# EAGLE schematic Main Brd (EAGLE 9.6.2)
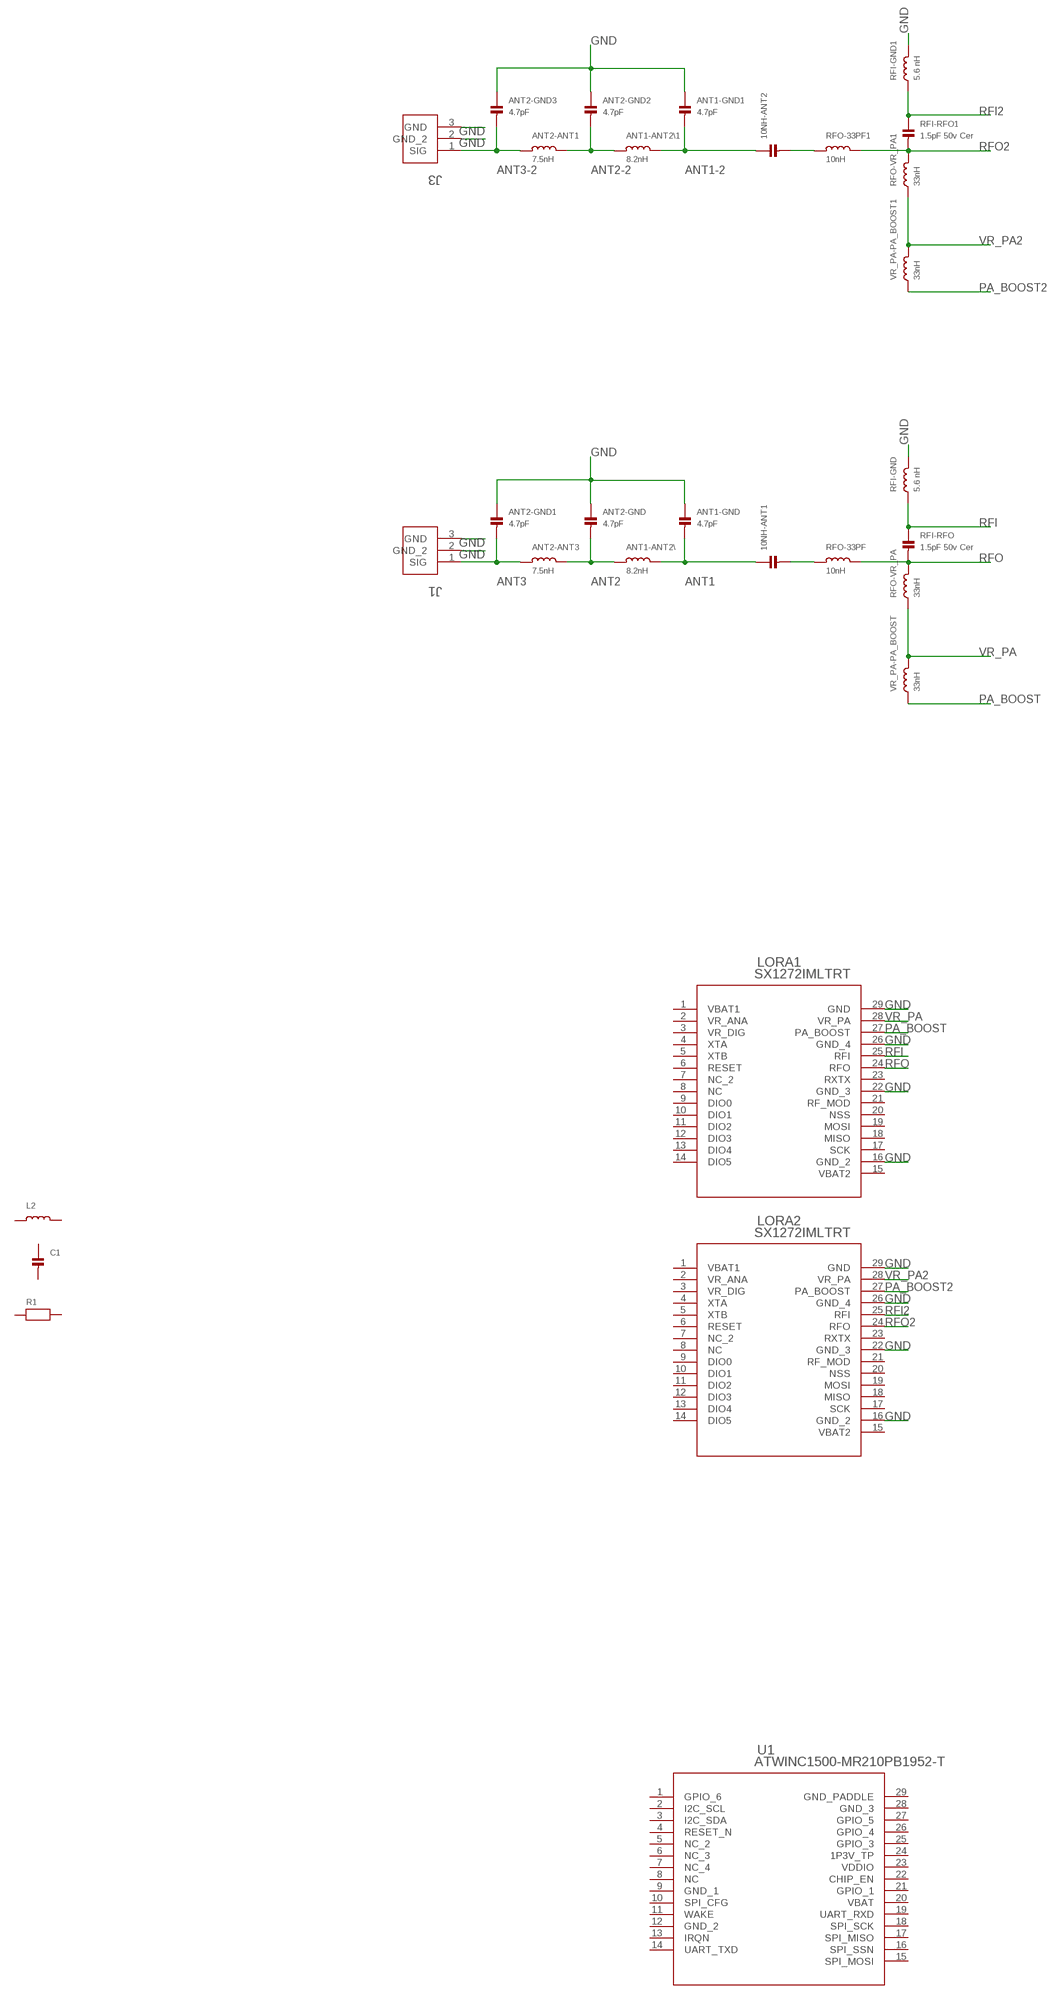
[diagram p0: schematic, sheet 1, part 1 of 2]
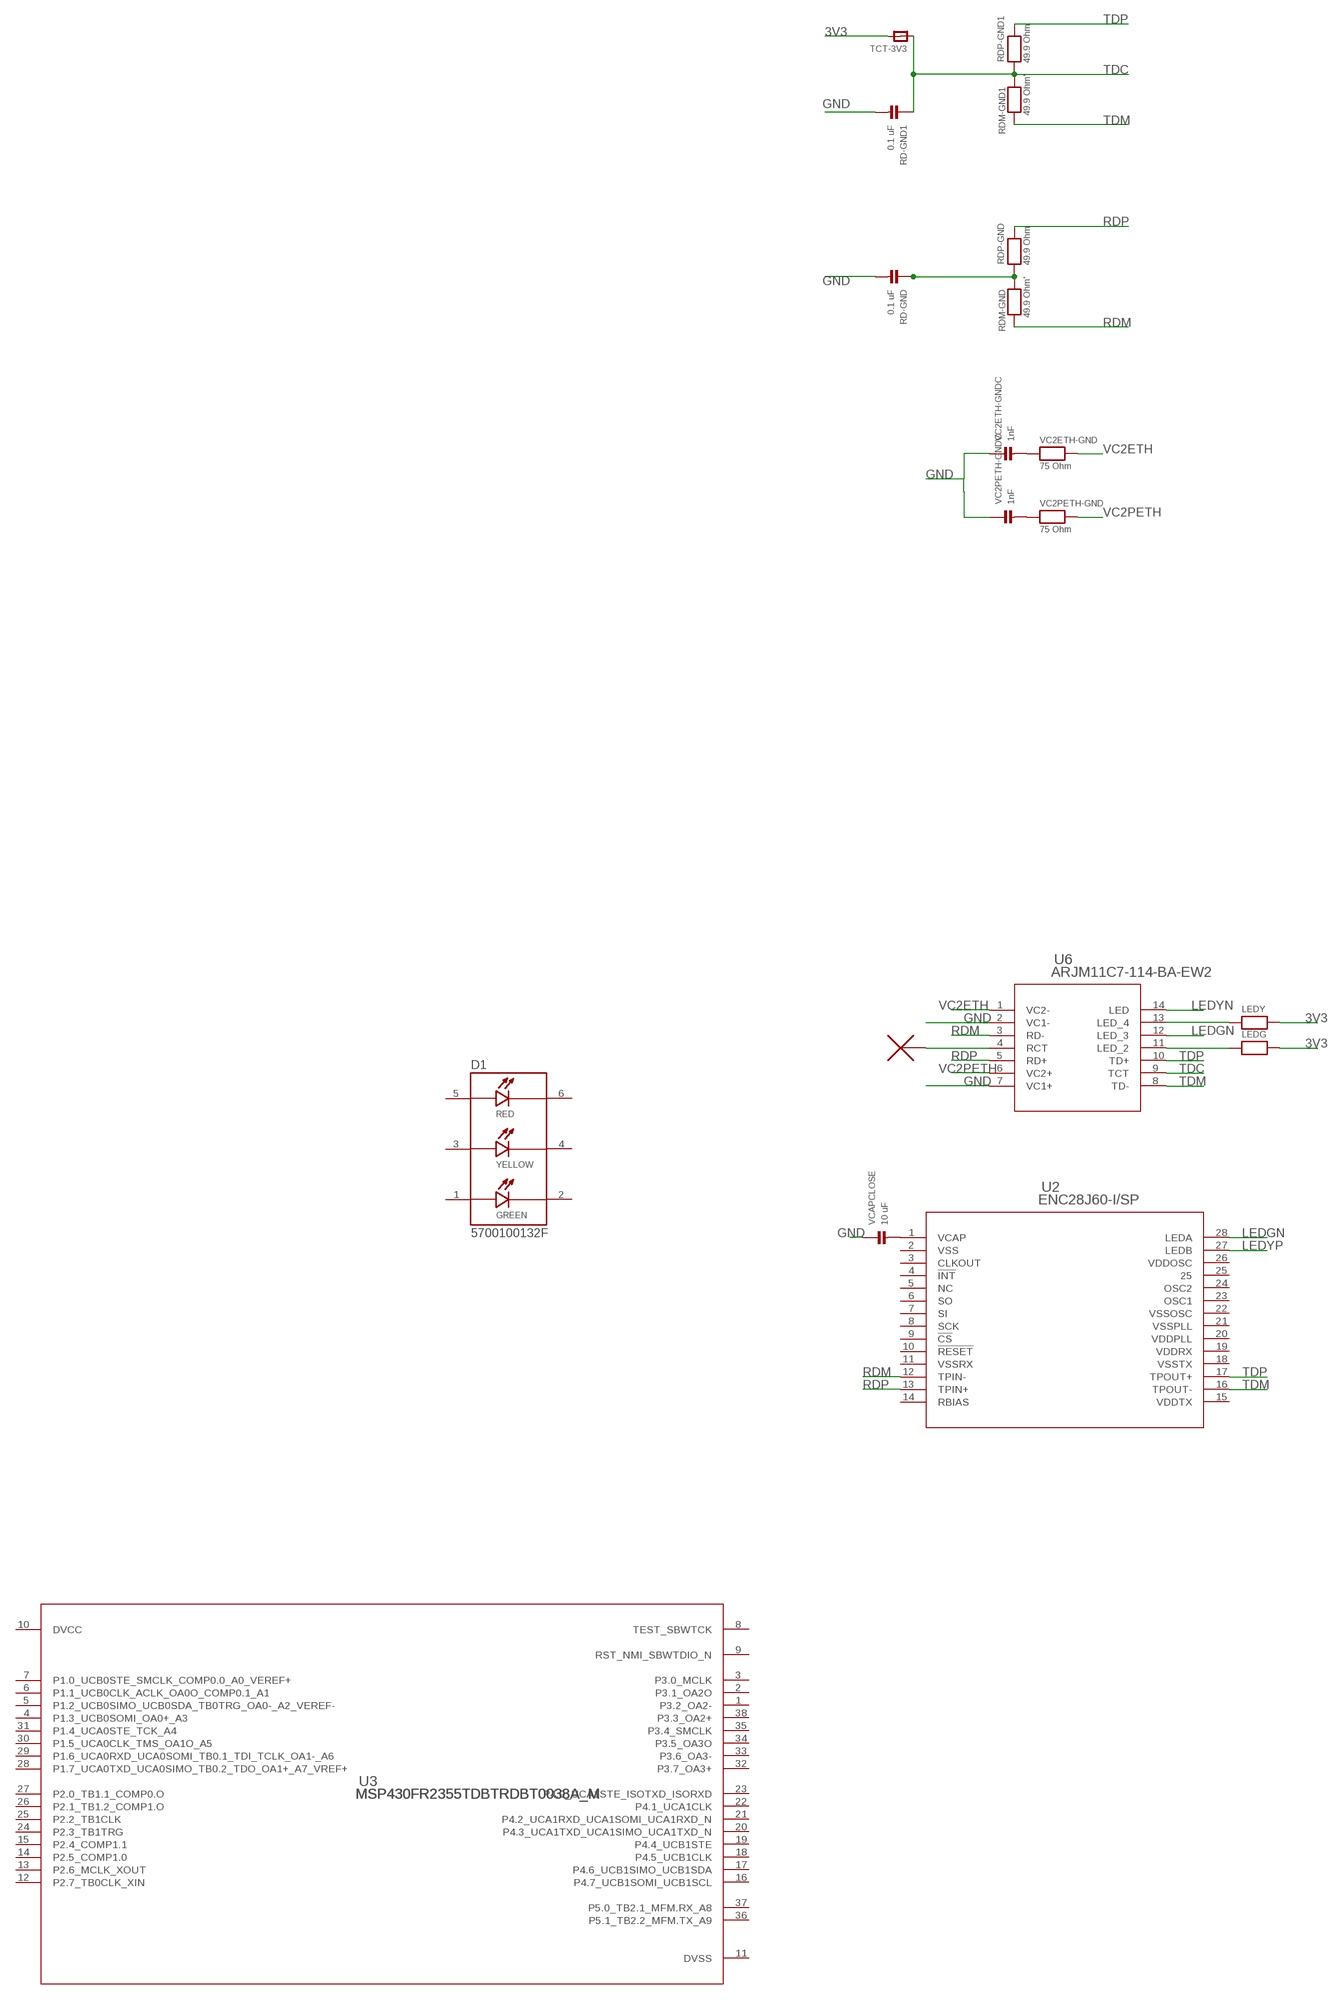
[diagram p1: schematic, sheet 1, part 2 of 2]

## Parts
10NH-ANT1  CAP_CERAMIC0402  [0402]
10NH-ANT2  CAP_CERAMIC0402  [0402]
ANT1-ANT2\  8.2nH  INDUCTOR_0402  [_0402]
ANT1-ANT2\1  8.2nH  INDUCTOR_0402  [_0402]
ANT1-GND  4.7pF  CAP_CERAMIC0402  [0402]
ANT1-GND1  4.7pF  CAP_CERAMIC0402  [0402]
ANT2-ANT1  7.5nH  INDUCTOR_0402  [_0402]
ANT2-ANT3  7.5nH  INDUCTOR_0402  [_0402]
ANT2-GND  4.7pF  CAP_CERAMIC0402  [0402]
ANT2-GND1  4.7pF  CAP_CERAMIC0402  [0402]
ANT2-GND2  4.7pF  CAP_CERAMIC0402  [0402]
ANT2-GND3  4.7pF  CAP_CERAMIC0402  [0402]
C1  CAP_CERAMIC0402  [0402]
D1  5700100132F  [LED_5700100132F]
J1  1909763-1  [CONN3_1909763_TEC]
J3  1909763-1  [CONN3_1909763_TEC]
L2  INDUCTOR_0402  [_0402]
LEDG  RESISTOR0402  [0402]
LEDY  RESISTOR0402  [0402]
LORA1  SX1272IMLTRT  [QFN28_6X6_SEM]
LORA2  SX1272IMLTRT  [QFN28_6X6_SEM]
R1  RESISTOR0402  [0402]
RD-GND  0.1 uF  CAP_CERAMIC0402  [0402]
RD-GND1  0.1 uF  CAP_CERAMIC0402  [0402]
RDM-GND  49.9 Ohm'  RESISTOR0402  [0402]
RDM-GND1  49.9 Ohm'  RESISTOR0402  [0402]
RDP-GND  49.9 Ohm  RESISTOR0402  [0402]
RDP-GND1  49.9 Ohm  RESISTOR0402  [0402]
RFI-GND  5.6 nH  INDUCTOR_0402  [_0402]
RFI-GND1  5.6 nH  INDUCTOR_0402  [_0402]
RFI-RFO  1.5pF 50v Cer  CAP_CERAMIC0402  [0402]
RFI-RFO1  1.5pF 50v Cer  CAP_CERAMIC0402  [0402]
RFO-33PF  10nH  INDUCTOR_0402  [_0402]
RFO-33PF1  10nH  INDUCTOR_0402  [_0402]
RFO-VR_PA  33nH  INDUCTOR_0402  [_0402]
RFO-VR_PA1  33nH  INDUCTOR_0402  [_0402]
TCT-3V3  FERRITE  [0603]
U1  ATWINC1500-MR210PB1952-T  [ATWINC15X0-MR210_MCH]
U2  ENC28J60-I/SP  [SPDIP28_300MC_MCH]
U3  MSP430FR2355TDBTRDBT0038A_M  [DBT0038A_M]
U6  ARJM11C7-114-BA-EW2  [ARJM11C7-114-BA-EW2_ABR]
U$1  NC_MARKER  (no package)
VC2ETH-GND  75 Ohm  RESISTOR0402  [0402]
VC2ETH-GNDC  1nF  CAP_CERAMIC0402  [0402]
VC2PETH-GND  75 Ohm  RESISTOR0402  [0402]
VC2PETH-GNDC  1nF  CAP_CERAMIC0402  [0402]
VCAPCLOSE  10 uF  CAP_CERAMIC0805  [0805]
VR_PA-PA_BOOST  33nH  INDUCTOR_0402  [_0402]
VR_PA-PA_BOOST1  33nH  INDUCTOR_0402  [_0402]

## Nets
3V3: LEDG.2 LEDY.2 TCT-3V3.2
ANT1: 10NH-ANT1.1 ANT1-ANT2\.2 ANT1-GND.2
ANT1-2: 10NH-ANT2.1 ANT1-ANT2\1.2 ANT1-GND1.2
ANT2: ANT1-ANT2\.1 ANT2-ANT3.2 ANT2-GND.2
ANT2-2: ANT1-ANT2\1.1 ANT2-ANT1.2 ANT2-GND2.2
ANT3: ANT2-ANT3.1 ANT2-GND1.2 J1.1(SIG)
ANT3-2: ANT2-ANT1.1 ANT2-GND3.2 J3.1(SIG)
GND: ANT1-GND1.1 ANT1-GND.1 ANT2-GND1.1 ANT2-GND2.1 ANT2-GND3.1 ANT2-GND.1 J1.2(GND_2) J1.3(GND) J3.2(GND_2) J3.3(GND) LORA1.16(GND_2) LORA1.22(GND_3) LORA1.26(GND_4) LORA1.29(GND) LORA2.16(GND_2) LORA2.22(GND_3) LORA2.26(GND_4) LORA2.29(GND) RD-GND1.2 RD-GND.2 RFI-GND1.2 RFI-GND.2 U6.2(VC1-) U6.7(VC1+) VC2ETH-GNDC.1 VC2PETH-GNDC.1 VCAPCLOSE.1
LEDGN: U2.28(LEDA) U6.12(LED_3)
LEDYN: U6.14(LED)
LEDYP: U2.27(LEDB)
N$1: 10NH-ANT1.2 RFO-33PF.1
N$2: 10NH-ANT2.2 RFO-33PF1.1
N$3: U6.4(RCT) U$1.P$1
N$4: U2.1(VCAP) VCAPCLOSE.2
N$5: VC2ETH-GND.1 VC2ETH-GNDC.2
N$6: VC2PETH-GND.1 VC2PETH-GNDC.2
N$7: LEDY.1 U6.13(LED_4)
N$8: RD-GND.1 RDM-GND.1 RDP-GND.1
N$9: LEDG.1 U6.11(LED_2)
PA_BOOST: LORA1.27(PA_BOOST) VR_PA-PA_BOOST.1
PA_BOOST2: LORA2.27(PA_BOOST) VR_PA-PA_BOOST1.1
RDM: RDM-GND.2 U2.12(TPIN-) U6.3(RD-)
RDP: RDP-GND.2 U2.13(TPIN+) U6.5(RD+)
RFI: LORA1.25(RFI) RFI-GND.1 RFI-RFO.1
RFI2: LORA2.25(RFI) RFI-GND1.1 RFI-RFO1.1
RFO: LORA1.24(RFO) RFI-RFO.2 RFO-33PF.2 RFO-VR_PA.2
RFO2: LORA2.24(RFO) RFI-RFO1.2 RFO-33PF1.2 RFO-VR_PA1.2
TDC: RD-GND1.1 RDM-GND1.1 RDP-GND1.1 TCT-3V3.1 U6.9(TCT)
TDM: RDM-GND1.2 U2.16(TPOUT-) U6.8(TD-)
TDP: RDP-GND1.2 U2.17(TPOUT+) U6.10(TD+)
VC2ETH: U6.1(VC2-) VC2ETH-GND.2
VC2PETH: U6.6(VC2+) VC2PETH-GND.2
VR_PA: LORA1.28(VR_PA) RFO-VR_PA.1 VR_PA-PA_BOOST.2
VR_PA2: LORA2.28(VR_PA) RFO-VR_PA1.1 VR_PA-PA_BOOST1.2
Unconnected: C1.1 C1.2 D1.1(A_GREEN) D1.2(C_GREEN) D1.3(A_YELLOW) D1.4(C_YELLOW) D1.5(A_RED) D1.6(C_RED) L2.1 L2.2 LORA1.4(XTA) LORA1.5(XTB) LORA1.6(RESET) LORA1.7(NC_2) LORA1.8(NC) LORA1.9(DIO0) LORA1.10(DIO1) LORA1.11(DIO2) LORA1.12(DIO3) LORA1.13(DIO4) LORA1.14(DIO5) LORA1.17(SCK) LORA1.18(MISO) LORA1.19(MOSI) LORA1.20(NSS) LORA1.21(RF_MOD) LORA1.23(RXTX) LORA2.4(XTA) LORA2.5(XTB) LORA2.6(RESET) LORA2.7(NC_2) LORA2.8(NC) LORA2.9(DIO0) LORA2.10(DIO1) LORA2.11(DIO2) LORA2.12(DIO3) LORA2.13(DIO4) LORA2.14(DIO5) LORA2.17(SCK) LORA2.18(MISO) LORA2.19(MOSI) LORA2.20(NSS) LORA2.21(RF_MOD) LORA2.23(RXTX) R1.1 R1.2 U1.1(GPIO_6) U1.2(I2C_SCL) U1.3(I2C_SDA) U1.4(RESET_N) U1.5(NC_2) U1.6(NC_3) U1.7(NC_4) U1.8(NC) U1.9(GND_1) U1.10(SPI_CFG) U1.11(WAKE) U1.12(GND_2) U1.13(IRQN) U1.14(UART_TXD) U1.15(SPI_MOSI) U1.16(SPI_SSN) U1.17(SPI_MISO) U1.18(SPI_SCK) U1.19(UART_RXD) U1.21(GPIO_1) U1.22(CHIP_EN) U1.24(1P3V_TP) U1.25(GPIO_3) U1.26(GPIO_4) U1.27(GPIO_5) U1.28(GND_3) U1.29(GND_PADDLE) U2.2(VSS) U2.3(CLKOUT) U2.4(!INT) U2.5(NC) U2.6(SO) U2.7(SI) U2.8(SCK) U2.9(!CS) U2.10(!RESET) U2.11(VSSRX) U2.14(RBIAS) U2.15(VDDTX) U2.18(VSSTX) U2.19(VDDRX) U2.20(VDDPLL) U2.21(VSSPLL) U2.22(VSSOSC) U2.23(OSC1) U2.24(OSC2) U2.25 U2.26(VDDOSC) U3.1(P3.2_OA2-) U3.2(P3.1_OA2O) U3.3(P3.0_MCLK) U3.4(P1.3_UCB0SOMI_OA0+_A3) U3.5(P1.2_UCB0SIMO_UCB0SDA_TB0TRG_OA0-_A2_VEREF-) U3.6(P1.1_UCB0CLK_ACLK_OA0O_COMP0.1_A1) U3.7(P1.0_UCB0STE_SMCLK_COMP0.0_A0_VEREF+) U3.8(TEST_SBWTCK) U3.9(RST_NMI_SBWTDIO_N) U3.12(P2.7_TB0CLK_XIN) U3.13(P2.6_MCLK_XOUT) U3.14(P2.5_COMP1.0) U3.15(P2.4_COMP1.1) U3.16(P4.7_UCB1SOMI_UCB1SCL) U3.17(P4.6_UCB1SIMO_UCB1SDA) U3.18(P4.5_UCB1CLK) U3.19(P4.4_UCB1STE) U3.20(P4.3_UCA1TXD_UCA1SIMO_UCA1TXD_N) U3.21(P4.2_UCA1RXD_UCA1SOMI_UCA1RXD_N) U3.22(P4.1_UCA1CLK) U3.23(P4.0_UCA1STE_ISOTXD_ISORXD) U3.24(P2.3_TB1TRG) U3.25(P2.2_TB1CLK) U3.26(P2.1_TB1.2_COMP1.O) U3.27(P2.0_TB1.1_COMP0.O) U3.28(P1.7_UCA0TXD_UCA0SIMO_TB0.2_TDO_OA1+_A7_VREF+) U3.29(P1.6_UCA0RXD_UCA0SOMI_TB0.1_TDI_TCLK_OA1-_A6) U3.30(P1.5_UCA0CLK_TMS_OA1O_A5) U3.31(P1.4_UCA0STE_TCK_A4) U3.32(P3.7_OA3+) U3.33(P3.6_OA3-) U3.34(P3.5_OA3O) U3.35(P3.4_SMCLK) U3.36(P5.1_TB2.2_MFM.TX_A9) U3.37(P5.0_TB2.1_MFM.RX_A8) U3.38(P3.3_OA2+)

## Power pins joined to a net without a drawn wire
DVCC: U3.10(DVCC)
DVSS: U3.11(DVSS)
VBAT: U1.20(VBAT)
VBAT1: LORA1.1(VBAT1) LORA2.1(VBAT1)
VBAT2: LORA1.15(VBAT2) LORA2.15(VBAT2)
VDDIO: U1.23(VDDIO)
VR_ANA: LORA1.2(VR_ANA) LORA2.2(VR_ANA)
VR_DIG: LORA1.3(VR_DIG) LORA2.3(VR_DIG)

## Library data of the parts
10NH-ANT1 10NH-ANT2 ANT1-GND ANT1-GND1 ANT2-GND ANT2-GND1-ANT2-GND3 C1 RD-GND RD-GND1 RFI-RFO RFI-RFO1 VC2ETH-GNDC VC2PETH-GNDC VCAPCLOSE = microbuilder:CAP_CERAMIC: Ceramic Capacitors 0402 - 0402 Surface Mount Capacitors 16pF 50V 5% [Digikey: 445-4899-2-ND] 18pF 50V 5% [Digikey: 490-1281-2-ND] 22pF 50V 5% [Digikey: 490-1283-2-ND] 68pF 50V 5% [Digikey: 490-1289-2-ND] 0.1uF 10V 10% [Digikey: 490-1318-2-ND] 1.0uF 6.3V 10% [Digikey: 490-1320-2-ND] 0603 - 0603 Surface Mount Capacitors 16 pF 50V 5% [Digikey: 445-5051-2-ND] 22 pF 50V [Digikey: PCC220ACVTR-ND] 33 pF 50V 5% [Digikey: 490-1415-1-ND] 56pF 50V 5% [Digikey: 490-1421-1-ND] 220pF 50V 5% [Digikey: 445-1285-1-ND] 680 pF 50V 2200 pF 50V 5% C0G [Digikey: 445-1297-1-ND] 5600 pF 100V 5% X7R [Digikey: 478-3711-1-ND] 0.1 µF 25V 10% [Digikey: PCC2277TR-ND] 0.22 µF 16V 10% X7R [Digikey: 445-1318-1-ND] 1.0 µF 25V 10% [Digikey: 445-5146-2-ND] 0603 - RF Specific 3pF 250V +/-0.1pF RF [Digikey: 712-1347-1-ND] 18 pF 250V 5% [Digikey: 478-3505-1-ND or 712-1322-1-ND] 56 pF 250V 5% C0G RF [Digikey: 490-4867-1-ND] 68 pF 250V RF [Digikey: 490-4868-1-ND] 0805 - 0805 Surface Mount Capacitors 220 pF 250V 2% RF Ceramic Capacitor [Digikey: 712-1398-1-ND] 1000 pF 50V 2% NP0 Ceramic Capacitor [Digikey: 478-3760-1-ND] 0.1 µF 25V 10% Ceramic Capacitor [Digikey: PCC1828TR-ND] 1.0 µF 16V 10% Ceramic Capacitor[Digikey: 490-1691-2-ND] 10.0 µF 10V 10% Ceramic Capacitor[Digikey: 709-1228-1-ND] 10.0 uF 16V 10% Ceramic Capacitor [Digikey: 478-5165-2-ND] 47 uF 6.3V 20% Ceramic Capacitor [Digikey: 587-1779-1-ND or 399-5506-1-ND] 1206 - 1206 Surface Mount Capacitors 47uF 10V 20% Ceramic Capacitor [Digikey: 490-5528-1-ND or 399-5508-1-ND or 445-6010-1-ND] 100uF 6.3V -20%, +80% Y5V Ceramic Capacitor (Digikey: 490-4512-1-ND, Mouser: 81-GRM31CF50J107ZE1L)
ANT1-ANT2\ ANT1-ANT2\1 ANT2-ANT1 ANT2-ANT3 L2 RFI-GND RFI-GND1 RFO-33PF RFO-33PF1 RFO-VR_PA RFO-VR_PA1 VR_PA-PA_BOOST VR_PA-PA_BOOST1 = microbuilder:INDUCTOR: Inductors 0603: 10nH Ceramic Inductor - microwire antenna/RF (Digikey: 712-1434-2-ND) 0805: 560nH Ceramic Inductor - RF (Digikey: 553-1047-1-ND) 270nH Ceramic Inductor - Q = 40@250MHz, +-5%, 1 Ohm DC Resistance (Digikey: 535-10506-2-ND) 1007 (2518 Metric) SMT: 10µH 10% 250mOhm 820mA 1007 Inductor (Digikey: 587-2189-1-ND) 22µH 10% 500mOhm 580mA 1007 Inductor (Digikey: 587-2190-1-ND) 47µH 10% 950mOhm 420mA 1007 Inductor (Digikey: 587-2191-1-ND) 47µH 5% 100mOhm 1A 1008 Inductor (Digikey: 732-1816-1-ND) 5.0x5.0mm (Taiyo Yuden NR5040 Series) 6.8µH 20% 2.3A 64mOhm Inductor (Digikey: 587-2374-2-ND) 5.0x5.0mm (TDK VLC5045 Series) 4.7µH 20% 3.3A 34mOhm Inductor (Digikey: 445-6526-1-ND) 6.8µH 20% 2.7A 46mOhm Inductor (Digikey: 445-6527-1-ND) 6.0x6.0mm (TDK VLC6045 Series) 4.7µH 20% 3.8A 27mOhm Inductor (Digikey: 445-6538-2-ND) 6.8µH 20% 3A 41mOhm Inductor (Digikey: 445-6540-1-ND) 6.2µH 30% 2.2A 45mOhm Inductor (Digikey: SRR5028-6R2YCT-ND) - Not TDK VLC6045 but footprint should match 6.0x6.0mm (TDK SLF6045 Series) 6.8uH 30% 2A 33mOhm Inductor (Digikey: 445-4572-1-ND, Mouser: 810-SLF645T6R8N2R0PF)
D1 = 473:5700100132F: LED Circuit Board Indicator 3 High Green (x 1), Red (x 1), Yellow (x 1) Diffused 2.2V Green, 2V Red, 2.1V Yellow 25mA Green, 30mA Red, 30mA Yellow Through Hole, Right Angle; DESCRIPTION: LED Circuit Board Indicator LED Circuit Board Indicator 3 High Green (x 1), Red (x 1), Yellow (x 1) Diffused 2.2V Green, 2V Red, 2.1V Yellow 25mA Green, 30mA Red, 30mA Yellow Round with Domed Top 2.00mm Dia Through Hole, Right Angle; DIGI-KEY_PART_NUMBER: 350-1809-ND; MF: Dialight; MP: 5700100132F; PACKAGE: None; PURCHASE-URL: https://pricing.snapeda.com/search/part/5700100132F/?ref=eda
J1 J3 = 473:1909763-1; COPYRIGHT: Copyright (C) 2022 Ultra Librarian. All rights reserved.; DIGI-KEY_PART_NUMBER_1: A118077CT-ND; DIGI-KEY_PART_NUMBER_2: A118077DKR-ND; DIGI-KEY_PART_NUMBER_3: A118077TR-ND; MANUFACTURER_PART_NUMBER: 1909763-1; MFR_NAME: TE Connectivity; TYPE: Jack
LEDG LEDY R1 RDM-GND RDM-GND1 RDP-GND RDP-GND1 VC2ETH-GND VC2PETH-GND = microbuilder:RESISTOR: Resistors 0402 - 0402 Surface Mount Package 22 Ohm 1% 1/16W [Digikey: 311-22.0LRTR-ND] 33 Ohm 5% 1/16W 1.0K 5% 1/16W 1.5K 5% 1/16W 2.0K 1% 1/16W 10.0K 1% 1/16W [Digikey: 311-10.0KLRTR-ND] 10.0K 5% 1/16W [Digikey: RMCF0402JT10K0TR-ND] 12.1K 1% 1/16W [Digikey: 311-22.0LRTR-ND] 100.0K 5% 1/16W 0603 - 0603 Surface Mount Package 0 Ohm 1/10 Watt 1% Resistor 15 Ohm 1/10 Watt 1% Resistor 33 Ohm 1/10 Watt 1% Resistor 49.9 Ohm 1/10 Watt 1% Resistor 100 Ohm 1/10 Watt 1% Resistor 150 Ohm 1/10 Watt 1% Resistor 240 Ohm 1/10 Watt 1% Resistor 390 Ohm 1/10 Watt 1% Resistor 560 Ohm 1/10 Watt 1% Resistor 680 Ohm 1/10 Watt 1% Resistor 750 Ohm 1/10 Watt 1% Resistor 1.0K Ohm 1/10 Watt 1% Resistor 1.5K Ohm 1/10 Watt 1% Resistor 2.0K Ohm 1/10 Watt 1% Resistor 2.2K Ohm 1/10 Watt 1% Resistor 3.3K Ohm 1/10 Watt 1% Resistor 4.7K Ohm 1/10 Watt 1% Resistor 10.0K Ohm 1/10 Watt 1% Resistor 12.0K Ohm 1/10 Watt 1% Resistor 12.1K Ohm 1/10 Watt 1% Resistor 20.0K Ohm 1/10 Watt 1% Resistor 33.0K Ohm 1/10 Watt 1% Resistor 100.0K Ohm 1/10 Watt 1% Resistor 0805 - 0805 Surface Mount Package 0 Ohm 1/8 Watt 1% Resistor 33 Ohm 1/8 Watt 1% Resistor 100 Ohm 1/8 Watt 1% Resistor 150 Ohm 1/8 Watt 1% Resistor 200 Ohm 1/8 Watt 1% Resistor 240 Ohm 1/8 Watt 1% Resistor 330 Ohm 1/8 Watt 1% Resistor 390 Ohm 1/8 Watt 1% Resistor 470 Ohm 1/8 Watt 1% Resistor 1.0K Ohm 1/8 Watt 1% Resistor 1.5K Ohm 1/8 Watt 1% Resistor 2.0K Ohm 1/8 Watt 1% Resistor 4.7K Ohm 1/8 Watt 1% Resistor 5.1K Ohm 1/8 Watt 1% Resistor 5.6K Ohm 1/8 Watt 1% Resistor 10.0K Ohm 1/8 Watt 1% Resistor 22.0K Ohm 1/8 Watt 1% Resistor 33.0K Ohm 1/8 Watt 1% Resistor 100K Ohm 1/8 Watt 1% Resistor 1206 - 1206 Surface Mount Package 2012 - 2010 Surface Mount Package 0.11 Ohm 1/2 Watt 1% Resistor - Digikey: RHM.11UCT-ND
LORA1 LORA2 = 473:SX1272IMLTRT; COPYRIGHT: Copyright (C) 2022 Ultra Librarian. All rights reserved.; DIGI-KEY_PART_NUMBER_1: SX1272IMLTRTTR-ND; DIGI-KEY_PART_NUMBER_2: SX1272IMLTRTCT-ND; DIGI-KEY_PART_NUMBER_3: SX1272IMLTRTDKR-ND; MANUFACTURER_PART_NUMBER: SX1272IMLTRT; MFR_NAME: Semtech
TCT-3V3 = microbuilder:FERRITE: Ferrite Bead 0603 MMZ1608B121C - 120 Ohm @ 100MHz, 600mA, 0.15 Ohm DC Resistance - Digikey: 445-2164-1-ND BK1608HW121-T - 120 Ohm, 600mA Ferrite Chip - Digikey: 587-1876-2-ND 0805 HZ0805B272R-10 - 2.7K Ohm @ 100MHz, 200mA, 0.8 Ohm DC Resistance - Digikey: 240-2504-1-ND (see also Murata BLM21BD272SN1L) MMZ2012Y152B - 1.5K Ohm @ 100MHz, 500mA, 0.4 Ohm DC Resistance - Digikey: 445-1560-1-ND - Mainly for high frequency (80-400MHz) MMZ2012R102A - 1K Ohm @ 100MHz, 500mA, 0.3 Ohm DC Resistance - Digikey: 445-1555-2-ND - More general purpose (10-200MHz)
U1 = 473:ATWINC1500-MR210PB1952-T; COPYRIGHT: Copyright (C) 2022 Ultra Librarian. All rights reserved.; DIGI-KEY_PART_NUMBER_1: ATWINC1500-MR210PB1952-TTR-ND; DIGI-KEY_PART_NUMBER_2: ATWINC1500-MR210PB1952-TCT-ND; DIGI-KEY_PART_NUMBER_3: ATWINC1500-MR210PB1952-TDKR-ND; MANUFACTURER_PART_NUMBER: ATWINC1500-MR210PB1952-T; MFR_NAME: Microchip
U2 = 473:ENC28J60-I/SP; COPYRIGHT: Copyright (C) 2022 Ultra Librarian. All rights reserved.; MANUFACTURER_PART_NUMBER: ENC28J60-I/SP; MFR_NAME: Microchip
U3 = 473:MSP430FR2355TDBTR; COPYRIGHT: Copyright (C) 2022 Ultra Librarian. All rights reserved.; DIGI-KEY_PART_NUMBER_1: 296-50259-1-ND; DIGI-KEY_PART_NUMBER_2: 296-50259-2-ND; DIGI-KEY_PART_NUMBER_3: 296-50259-6-ND; MANUFACTURER_PART_NUMBER: MSP430FR2355TDBTR; MFR_NAME: Texas Instruments; REFDES: RefDes; TYPE: TYPE
U6 = 473:ARJM11C7-114-BA-EW2; COPYRIGHT: Copyright (C) 2022 Ultra Librarian. All rights reserved.; DIGI-KEY_PART_NUMBER_1: 2266-ARJM11C7-114-BA-EW2-ND; DIGI-KEY_PART_NUMBER_2: 535-14168-ND; MANUFACTURER_PART_NUMBER: ARJM11C7-114-BA-EW2; MFR_NAME: Abracon
U$1 = NC_MARKER:NC_MARKER